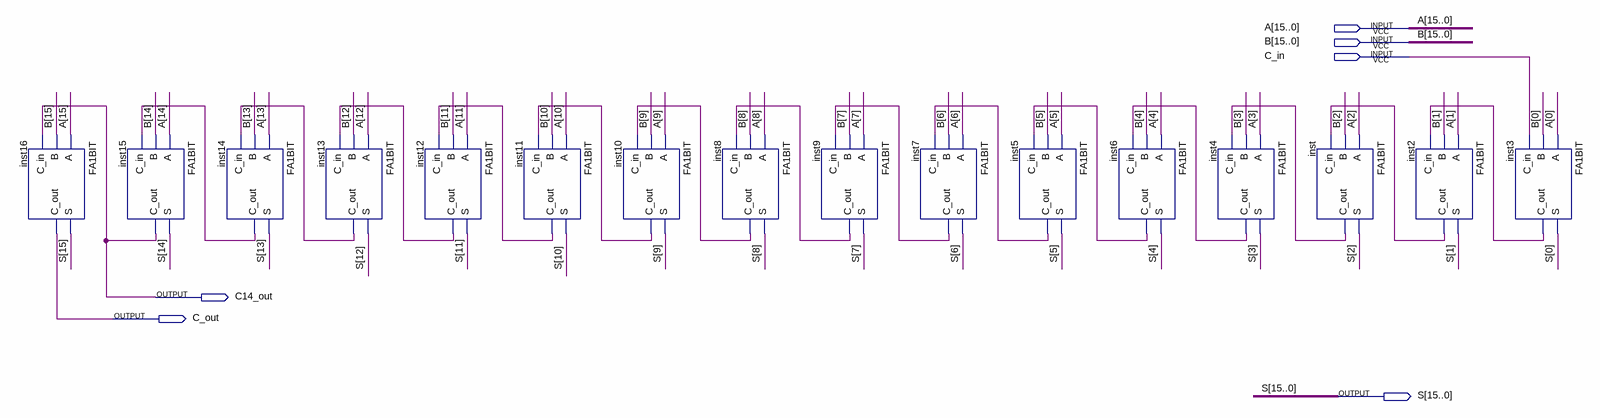
[diagram p0: schematic sheet]
// Quartus schematic FA16BIT.bdf as structural Verilog: 16 symbols, 6 pins
module FA16BIT (
  input  [15:0] A,
  input  [15:0] B,
  input  C_in,
  output C14_out,
  output C_out,
  output [15:0] S
);

  wire inst2_c_out, inst3_c_out, inst4_c_out, inst5_c_out, inst6_c_out, inst7_c_out, inst8_c_out,
       inst9_c_out, inst10_c_out, inst11_c_out, inst12_c_out, inst13_c_out, inst14_c_out, inst_c_out;

  FA1BIT inst16 (.A(A[15]), .B(B[15]), .C_in(C14_out), .S(S[15]), .C_out(C_out));
  FA1BIT inst15 (.A(A[14]), .B(B[14]), .C_in(inst14_c_out), .S(S[14]), .C_out(C14_out));
  FA1BIT inst14 (.A(A[13]), .B(B[13]), .C_in(inst13_c_out), .S(S[13]), .C_out(inst14_c_out));
  FA1BIT inst13 (.A(A[12]), .B(B[12]), .C_in(inst12_c_out), .S(S[12]), .C_out(inst13_c_out));
  FA1BIT inst12 (.A(A[11]), .B(B[11]), .C_in(inst11_c_out), .S(S[11]), .C_out(inst12_c_out));
  FA1BIT inst11 (.A(A[10]), .B(B[10]), .C_in(inst10_c_out), .S(S[10]), .C_out(inst11_c_out));
  FA1BIT inst10 (.A(A[9]), .B(B[9]), .C_in(inst8_c_out), .S(S[9]), .C_out(inst10_c_out));
  FA1BIT inst8 (.A(A[8]), .B(B[8]), .C_in(inst9_c_out), .S(S[8]), .C_out(inst8_c_out));
  FA1BIT inst9 (.A(A[7]), .B(B[7]), .C_in(inst7_c_out), .S(S[7]), .C_out(inst9_c_out));
  FA1BIT inst7 (.A(A[6]), .B(B[6]), .C_in(inst5_c_out), .S(S[6]), .C_out(inst7_c_out));
  FA1BIT inst5 (.A(A[5]), .B(B[5]), .C_in(inst6_c_out), .S(S[5]), .C_out(inst5_c_out));
  FA1BIT inst6 (.A(A[4]), .B(B[4]), .C_in(inst4_c_out), .S(S[4]), .C_out(inst6_c_out));
  FA1BIT inst4 (.A(A[3]), .B(B[3]), .C_in(inst_c_out), .S(S[3]), .C_out(inst4_c_out));
  FA1BIT inst (.A(A[2]), .B(B[2]), .C_in(inst2_c_out), .S(S[2]), .C_out(inst_c_out));
  FA1BIT inst2 (.A(A[1]), .B(B[1]), .C_in(inst3_c_out), .S(S[1]), .C_out(inst2_c_out));
  FA1BIT inst3 (.A(A[0]), .B(B[0]), .C_in(C_in), .S(S[0]), .C_out(inst3_c_out));
endmodule
